# Altium schematic sheet horizontal_counter.SchDoc
size A4; SheetNumber: 2; SheetTotal: 4
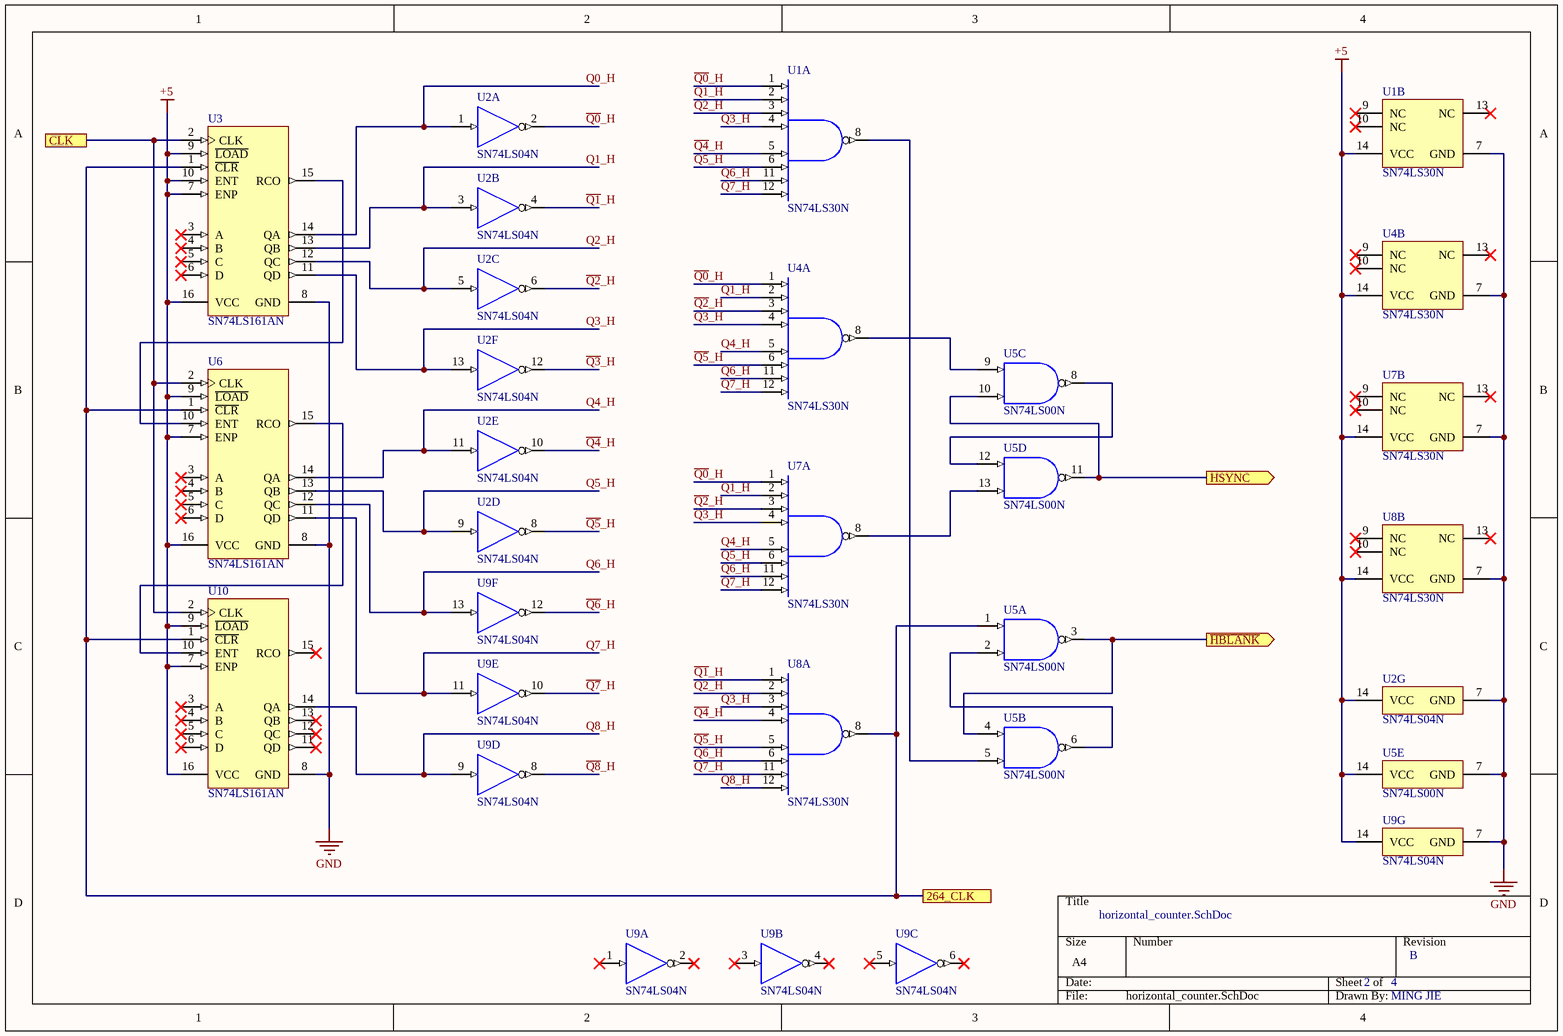
[diagram p0: horizontal_counter.SchDoc]

## Parts
U1  SN74LS30N  [N0014A]  (parts A,B of 2)
U2  SN74LS04N  [N0014A]  (parts A,B,C,D,E,F,G of 7)
U3  SN74LS161AN  [N0016A]
U4  SN74LS30N  [N0014A]  (parts A,B of 2)
U5  SN74LS00N  [N0014A]  (parts A,B,C,D,E of 5)
U6  SN74LS161AN  [N0016A]
U7  SN74LS30N  [N0014A]  (parts A,B of 2)
U8  SN74LS30N  [N0014A]  (parts A,B of 2)
U9  SN74LS04N  [N0014A]  (parts A,B,C,D,E,F,G of 7)
U10  SN74LS161AN  [N0016A]

## Ports
264_CLK, CLK, HSYNC (out), ~{HBLANK} (out)

## Nets
+5: U1.14(VCC) U2.14(VCC) U3.7(ENP) U3.9(~{LOAD}) U3.10(ENT) U3.16(VCC) U4.14(VCC) U5.14(VCC) U6.7(ENP) U6.9(~{LOAD}) U6.16(VCC) U7.14(VCC) U8.14(VCC) U9.14(VCC) U10.7(ENP) U10.9(~{LOAD}) U10.16(VCC)
GND: U1.7(GND) U2.7(GND) U3.8(GND) U4.7(GND) U5.7(GND) U6.8(GND) U7.7(GND) U8.7(GND) U9.7(GND) U10.8(GND)
264_CLK: U3.1(~{CLR}) U5.1(1A) U6.1(~{CLR}) U8.8(~{Y}) U10.1(~{CLR}) ; port 264_CLK
CLK: U3.2(CLK) U6.2(CLK) U10.2(CLK) ; port CLK
~{HBLANK}: U5.3(1Y) U5.4(2A) ; port ~{HBLANK}
HSYNC: U5.10(3B) U5.11(4Y) ; port HSYNC
Q0_H: U2.1(1A) U3.14(QA)
Q1_H: U2.3(2A) U3.13(QB) U4.2(B) U7.2(B)
Q2_H: U2.5(3A) U3.12(QC)
Q3_H: U1.4(D) U2.13(6A) U3.11(QD) U8.3(C)
Q4_H: U2.11(5A) U4.5(E) U6.14(QA) U7.5(E)
Q5_H: U2.9(4A) U6.13(QB) U7.6(F)
Q6_H: U1.11(G) U4.11(G) U6.12(QC) U7.11(G) U9.13(6A)
Q7_H: U1.12(H) U4.12(H) U6.11(QD) U7.12(H) U9.11(5A)
Q8_H: U8.12(H) U9.9(4A) U10.14(QA)
~{Q0}_H: U1.1(A) U2.2(~{1Y}) U4.1(A) U7.1(A)
~{Q1}_H: U1.2(B) U2.4(~{2Y}) U8.1(A)
~{Q2}_H: U1.3(C) U2.6(~{3Y}) U4.3(C) U7.3(C) U8.2(B)
~{Q3}_H: U2.12(~{6Y}) U4.4(D) U7.4(D)
~{Q4}_H: U1.5(E) U2.10(~{5Y}) U8.4(D)
~{Q5}_H: U1.6(F) U2.8(~{4Y}) U4.6(F) U8.5(E)
~{Q6}_H: U8.6(F) U9.12(~{6Y})
~{Q7}_H: U8.11(G) U9.10(~{5Y})
~{Q8}_H: U9.8(~{4Y})
NetU1_8: U1.8(~{Y}) U5.5(2B)
NetU3_15: U3.15(RCO) U6.10(ENT)
NetU4_8: U4.8(~{Y}) U5.9(3A)
NetU5_2: U5.2(1B) U5.6(2Y)
NetU5_8: U5.8(3Y) U5.12(4A)
NetU5_13: U5.13(4B) U7.8(~{Y})
NetU6_15: U6.15(RCO) U10.10(ENT)

Not connected (* = marked no-connect by the designer): U1 9(NC)* 10(NC)* 13(NC)*; U3 3(A)* 4(B)* 5(C)* 6(D)*; U4 9(NC)* 10(NC)* 13(NC)*; U6 3(A)* 4(B)* 5(C)* 6(D)*; U7 9(NC)* 10(NC)* 13(NC)*; U8 9(NC)* 10(NC)* 13(NC)*; U9 1(1A)* 2(~{1Y})* 3(2A)* 4(~{2Y})* 5(3A)* 6(~{3Y})*; U10 3(A)* 4(B)* 5(C)* 6(D)* 11(QD)* 12(QC)* 13(QB)* 15(RCO)*

## Notes on the sheet
- B
- MING JIE

## Library data of the parts
U1 U4 U7 U8 = CMP-1627-00459-2: 8-input positive-NAND gates, N0014A, TUBE; Manufacturer: Texas Instruments; ICC @ Nom Voltage(Max)(mA): 0.006; Rating: Catalog; VCC(Min)(V): 4.75; Voltage(Nom)(V): 5; Input Type: TTL; F @ Nom Voltage(Max)(Mhz): 35; tpd @ Nom Voltage(Max)(ns): 22; Bits(#): 1; Technology Family: LS; Output Drive (IOL/IOH)(Max)(mA): 0.4/-16; Schmitt Trigger: No; VCC(Max)(V): 5.25; PackageReference: N0014A; Code_JEDEC: MS-001; Generic Part Number: SN74LS30; Output Type: TTL; DatasheetVersion: SDLS099; Operating Temperature Range(C): 0 to 70
U2 U9 = CMP-1615-00911-2: Hex inverters, N0014A, TUBE; Manufacturer: Texas Instruments; Output Drive (IOL/IOH)(Max)(mA): -0.4/8; Schmitt Trigger: No; F @ Nom Voltage(Max)(Mhz): 35; Voltage(Nom)(V): 5; Technology Family: LS; Input Type: TTL; Output Type: CMOS; Bits(#): 6; VCC(Max)(V): 5.25; ICC @ Nom Voltage(Max)(mA): 0.033; Rating: Catalog; VCC(Min)(V): 4.75; tpd @ Nom Voltage(Max)(ns): 22; Operating Temperature Range(C): 0 to 70; DatasheetVersion: SDLS029C; Generic Part Number: SN74LS04; Code_JEDEC: MS-001; PackageReference: N0014A
U3 U6 U10 = CMP-1623-00512-2: Synchronous 4-Bit Binary Counters, N0016A, TUBE; Manufacturer: Texas Instruments; VCC(Max)(V): 5.25; tpd @ Nom Voltage(Max)(ns): 35; Output Type: CMOS; Input Type: TTL; ICC @ Nom Voltage(Max)(mA): 32; VCC(Min)(V): 4.75; Technology Family: LS; Voltage(Nom)(V): 5; Output Drive (IOL/IOH)(Max)(mA): 8/-0.4; Inputs: 1; Schmitt Trigger: No; Rating: Catalog; Bits(#): 4; Type: Binary; Generic Part Number: SN74LS161A; Code_JEDEC: MS-001; F @ Nom Voltage(Max)(Mhz): 35; Function: Counter; PackageReference: N0016A; DatasheetVersion: SDLS060; Operating Temperature Range(C): 0 to 70
U5 = CMP-1627-00476-2: Quad 2-input positive-NAND gates, N0014A, TUBE; Manufacturer: Texas Instruments; VCC(Min)(V): 4.75; F @ Nom Voltage(Max)(Mhz): 35; Voltage(Nom)(V): 5; Rating: Catalog; tpd @ Nom Voltage(Max)(ns): 22; Output Type: TTL; Schmitt Trigger: No; Output Drive (IOL/IOH)(Max)(mA): 0.4/-16; Technology Family: LS; ICC @ Nom Voltage(Max)(mA): 0.022; VCC(Max)(V): 5.25; Bits(#): 4; Code_JEDEC: MS-001; Generic Part Number: SN74LS00; Input Type: TTL; Operating Temperature Range(C): 0 to 70; PackageReference: N0014A; DatasheetVersion: SDLS025B